# Altium schematic sheet ESP32_C6_Schematic.SchDoc
size A; SheetNumber: 2; SheetTotal: 5
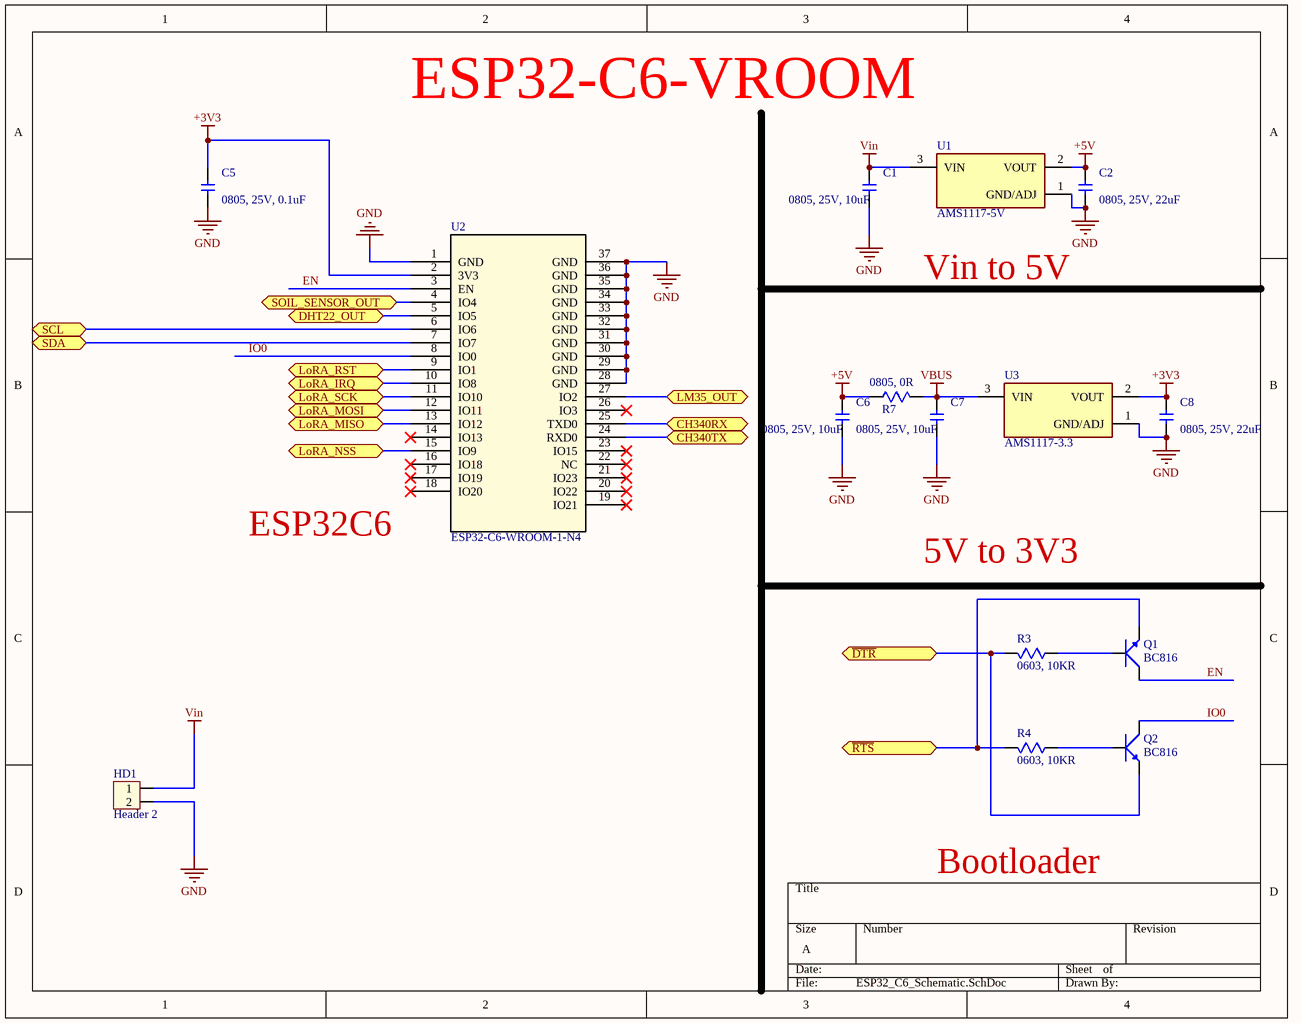
[diagram p0: ESP32_C6_Schematic.SchDoc]

## Parts
C1  0805, 25V, 10uF  [C0805]
C2  0805, 25V, 22uF  [C0805]
C5  0805, 25V, 0.1uF  [C0805]
C6  0805, 25V, 10uF  [C0805]
C7  0805, 25V, 10uF  [C0805]
C8  0805, 25V, 22uF  [C0805]
HD1  Header 2  [HED2]
Q1  BC816  [SOT95P237X111-3N]
Q2  BC816  [SOT95P237X111-3N]
R3  0603, 10KR  [RES0603]
R4  0603, 10KR  [RES0603]
R7  0805, 0R  [C0805]
U1  AMS1117-5V  [SOT229P700X180-4N]
U2  ESP32-C6-WROOM-1-N4  [MOD28_ESP32-C6-WROOM-1_EXP]
U3  AMS1117-3.3  [SOT229P700X180-4N]

## Ports
CH340RX (bidir), CH340TX (bidir), DHT22_OUT (bidir), LM35_OUT (bidir), LoRA_IRQ (bidir), LoRA_MISO (bidir), LoRA_MOSI (bidir), LoRA_NSS (bidir), LoRA_RST (bidir), LoRA_SCK (bidir), SCL (bidir), SDA (bidir), SOIL_SENSOR_OUT (bidir), ~{DTR} (bidir), ~{RTS} (bidir)

## Nets
+3V3: C5.2 C8.2 U2.2(3V3) U3.2(VOUT)
+5V: C2.2 C6.2 R7.1 U1.2(VOUT)
GND: C1.1 C2.1 C5.1 C6.1 C7.1 C8.1 HD1.2 U1.1(GND/ADJ) U2.1(GND) U2.28(GND) U2.29(GND) U2.30(GND) U2.31(GND) U2.32(GND) U2.33(GND) U2.34(GND) U2.35(GND) U2.36(GND) U2.37(GND) U3.1(GND/ADJ)
VBUS: C7.2 R7.2 U3.3(VIN)
Vin: C1.2 HD1.1 U1.3(VIN)
CH340RX: U2.25(TXD0) ; port CH340RX
CH340TX: U2.24(RXD0) ; port CH340TX
~{DTR}: Q2.2(E) R3.2 ; port ~{DTR}
DHT22_OUT: U2.5(IO5) ; port DHT22_OUT
EN: Q1.3(C) U2.3(EN)
IO0: Q2.3(C) U2.8(IO0)
LM35_OUT: U2.27(IO2) ; port LM35_OUT
LoRA_IRQ: U2.10(IO8) ; port LoRA_IRQ
LoRA_MISO: U2.13(IO12) ; port LoRA_MISO
LoRA_MOSI: U2.12(IO11) ; port LoRA_MOSI
LoRA_NSS: U2.15(IO9) ; port LoRA_NSS
LoRA_RST: U2.9(IO1) ; port LoRA_RST
LoRA_SCK: U2.11(IO10) ; port LoRA_SCK
~{RTS}: Q1.2(E) R4.2 ; port ~{RTS}
SCL: U2.6(IO6) ; port SCL
SDA: U2.7(IO7) ; port SDA
SOIL_SENSOR_OUT: U2.4(IO4) ; port SOIL_SENSOR_OUT
NetQ1_1: Q1.1(B) R3.1
NetQ2_1: Q2.1(B) R4.1

Not connected (* = marked no-connect by the designer): U2 14(IO13)* 16(IO18)* 17(IO19)* 18(IO20)* 19(IO21)* 20(IO22)* 21(IO23)* 22(NC)* 23(IO15)* 26(IO3)*

## Notes on the sheet
- ESP32-C6-VROOM
- Vin to 5V
- ESP32C6
- 5V to 3V3
- Bootloader

## Library data of the parts
C1 C2 C5-C8 = C0805: Part Number: *; MFR: *
HD1 = Hed2: Header 2 (Green); Value: Header 2
Q1 Q2 = BC816: Transistor NPN 45V 0.5A hfe160 SOT23 | ON Semiconductor BC817-25LT1G; SnapEDA_Link: https://www.snapeda.com/parts/BC817-25LT1G/Onsemi/view-part/?ref=snap; Package: SOT-23-3 ON Semiconductor; Value: *; MF: ON Semiconductor; MP: BC817-25LT1G; Check_prices: https://www.snapeda.com/parts/BC817-25LT1G/Onsemi/view-part/?ref=eda
R3 R4 = R0603: Part Number: *; MFR: *
R7 = R0805: Part Number: *; MFR: *
U1 = AMS1117-5V: Sot223/Pkg 1-Amp 5V-Volt Low Drop Out Voltage Regulatator; MF: Advanced Monolithic Systems; MP: AMS1117-3.3; SnapEDA_Link: https://www.snapeda.com/parts/AMS1117-3.3/Advanced+Monolithic+Systems/view-part/?ref=snap; Package: SOT-223 Seeed Technology; Value: *; Check_prices: https://www.snapeda.com/parts/AMS1117-3.3/Advanced+Monolithic+Systems/view-part/?ref=eda
U2 = ESP32-C6-WROOM-1-N4: Description; Manufacturer_Name: Espressif Systems; Type: RF; Copyright: Copyright (C) 2025 Ultra Librarian. All rights reserved.; Manufacturer_Part_Number: ESP32-C6-WROOM-1-N4; RefDes: RefDes
U3 = AMS1117-3.3: Sot223/Pkg 1-Amp 3.3-Volt Low Drop Out Voltage Regulatator; MF: Advanced Monolithic Systems; SnapEDA_Link: https://www.snapeda.com/parts/AMS1117-3.3/Advanced+Monolithic+Systems/view-part/?ref=snap; Package: SOT-223 Seeed Technology; Value: *; MP: AMS1117-3.3; Check_prices: https://www.snapeda.com/parts/AMS1117-3.3/Advanced+Monolithic+Systems/view-part/?ref=eda